# EAGLE board Main 4000 Model PI COMP REV1A (EAGLE 7.4.0)
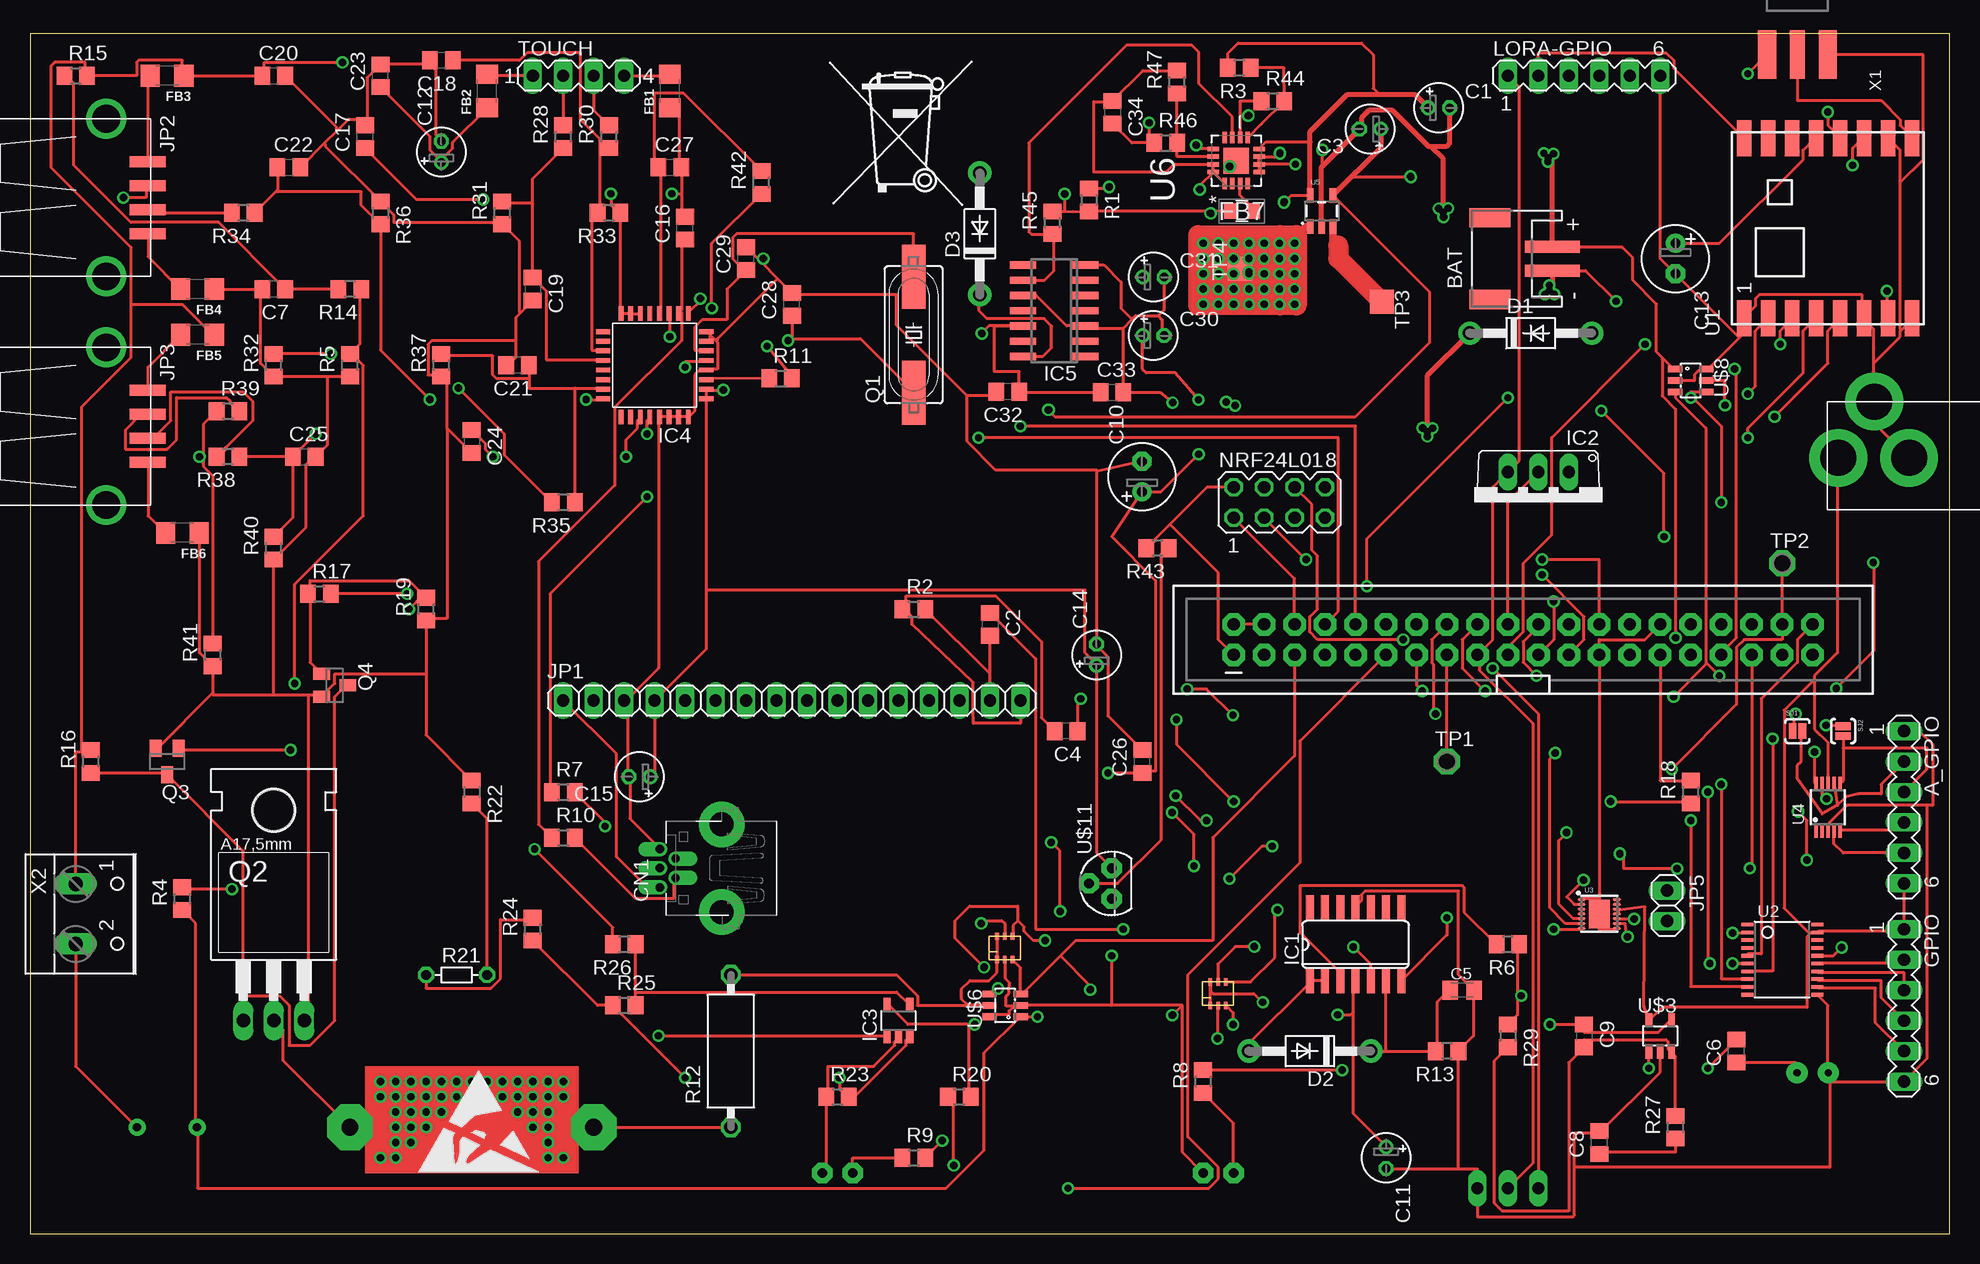
[diagram p4: board, top side]
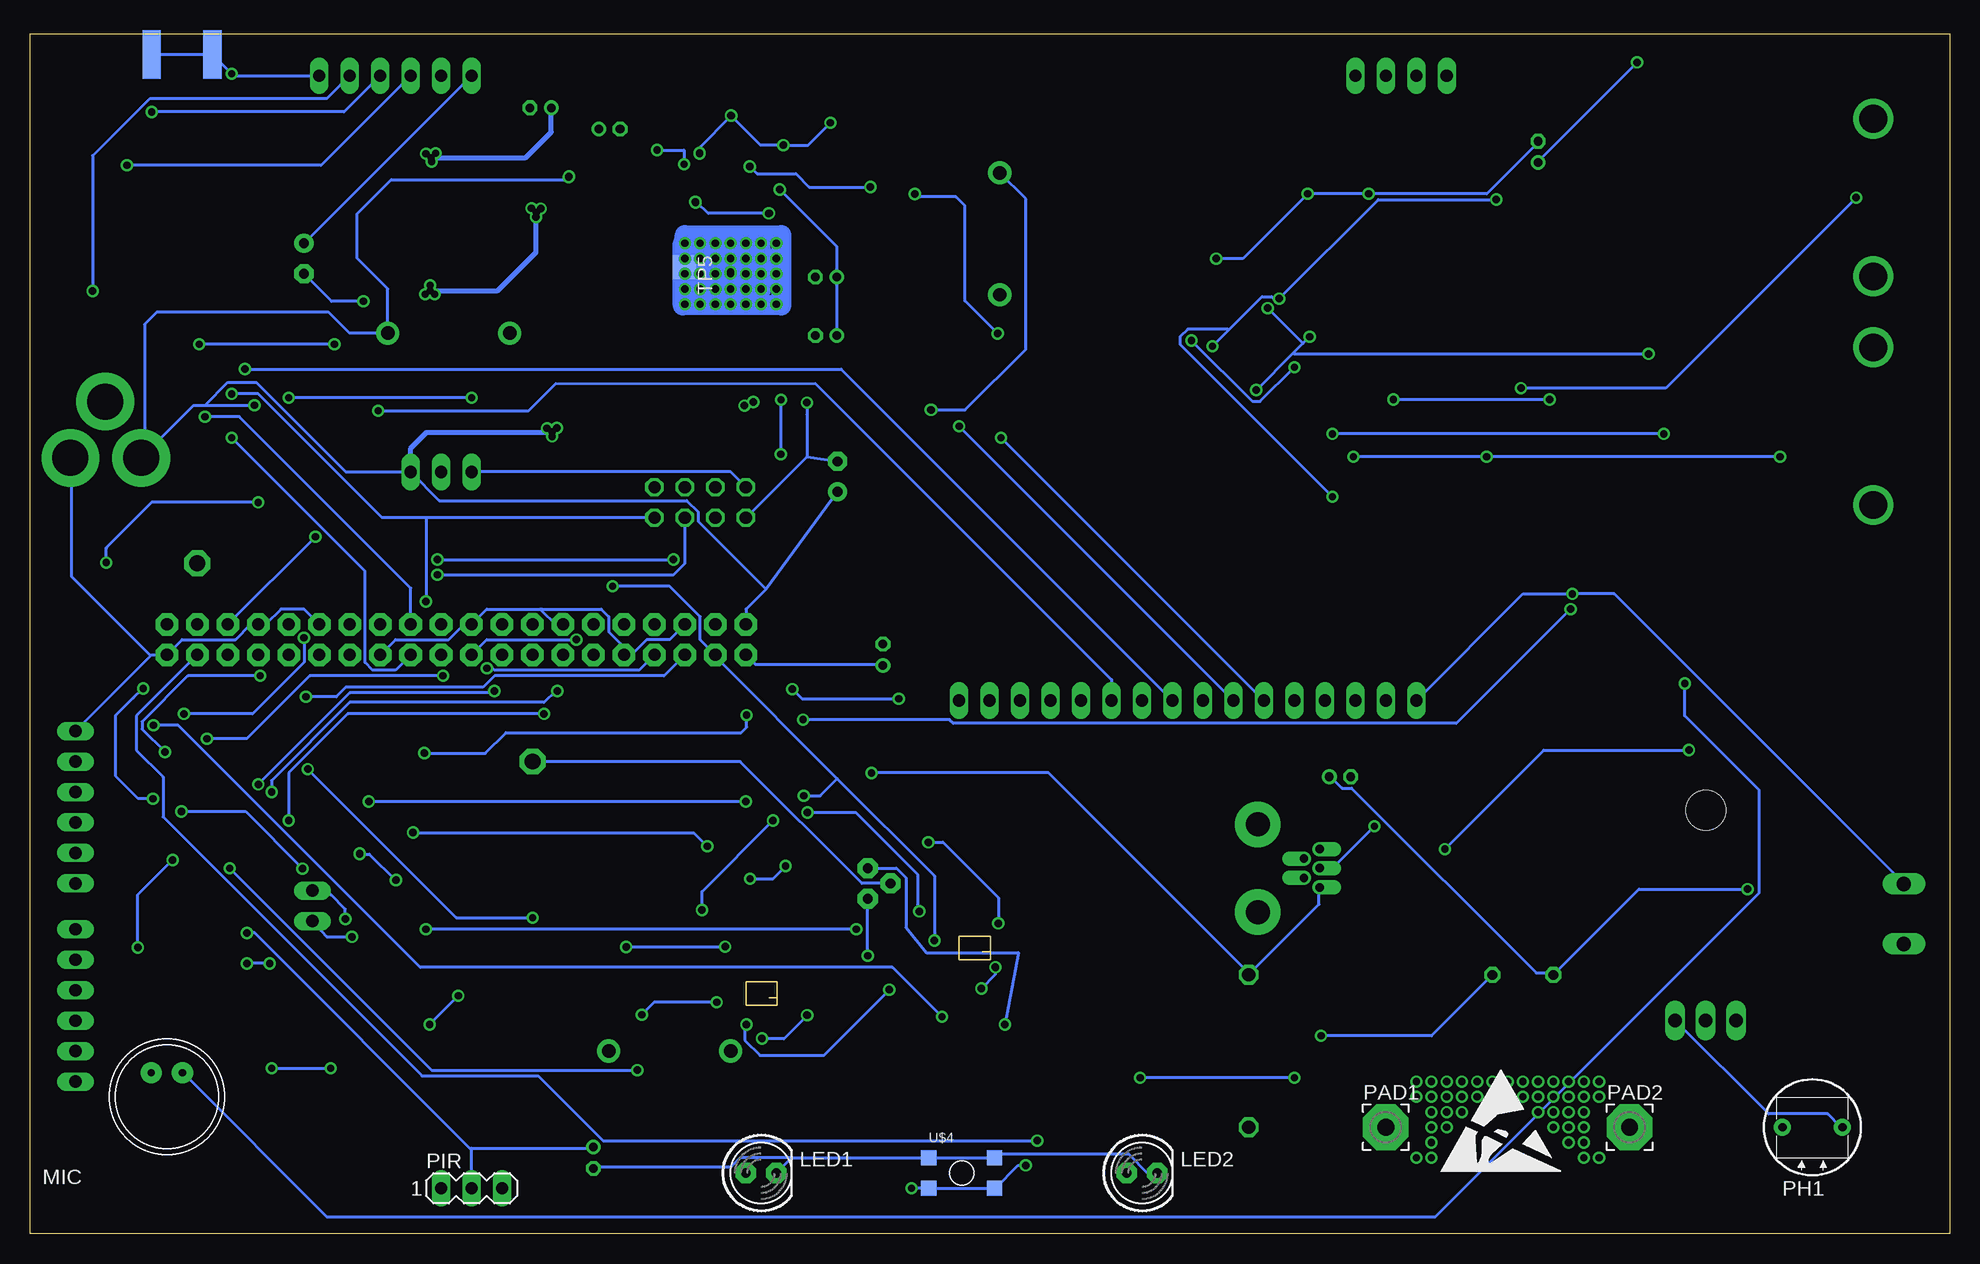
[diagram p5: board, bottom side, seen from below]

Size 160 x 100 mm. Coordinates in mm from the lower left corner, seen from the top.
Outline: 0,0 160,0 160,100 0,100 0,0
Copper layers (1*16): Top 0.035mm / dielectric 1.5mm / Bottom 0.035mm
Design rules "default": minimum track width 10mil, minimum drill 24mil, track to track 8mil, track to pad 8mil, pad to pad 8mil, via to via 8mil, smd to smd 8mil, copper to edge 40mil, drill to drill 8mil, minimum pad ring 10mil, minimum via ring 8mil, stop-mask expansion 4mil, vias tented up to drill 0mil, thermal gap 10mil

## Footprints (pad centres in the part's own frame; a part is rotated, then mirrored left to right if it is on the bottom)
MA06-1 = drill 1.016 long: 1 -6.35,0; 2 -3.81,0; 3 -1.27,0; 4 1.27,0; 5 3.81,0; 6 6.35,0
JST-PH-2-SMT-RA = smd 1 x 4.6: 1 1,-3.7; 2 -1,-3.7 | smd 1.6 x 3.4: NC1 -3.4,1.5; NC2 3.4,1.5
E1,8-4 = drill 0.711 pad 1.168: + -0.889,0 | drill 0.711 pad 1.168 octagon: - 0.889,0
C0805 = smd 1.3 x 1.5: 1 -0.95,0; 2 0.95,0
C0805K = smd 1.3 x 1.6: 1 -1,0; 2 1,0
E2,5-6 = drill 0.813 pad 1.6: + -1.27,0 | drill 0.813 pad 1.6 octagon: - 1.27,0
USB-MINIB-THM-MOLEX = drill 0.7 offset: D+ 0,9.72; D- -0.8,8.42; GND 1.6,9.72; ID 0.8,8.42; VBUS -1.6,9.72 | drill 2 pad 3.81: GND1 -3.65,4.57; GND4 3.65,4.57
DO41-10 = drill 1.118 pad 1.93: A 5.08,0; C -5.08,0
FB1206 = smd 1.6 x 1.8: 1 -1.4,0; 2 1.4,0
SMD0805-A = smd 1 x 1.3: P$1 -1,0; P$2 1,0
SO14 = smd 0.66 x 2.032: 1 -3.81,-3.073; 2 -2.54,-3.073; 3 -1.27,-3.073; 4 0,-3.073; 5 1.27,-3.073; 6 2.54,-3.073; 7 3.81,-3.073; 8 3.81,3.073; 9 2.54,3.073; 10 1.27,3.073; 11 0,3.073; 12 -1.27,3.073; 13 -2.54,3.073; 14 -3.81,3.073
TO220V = drill 1.016 long: 1 -2.54,-2.54; 2 0,-2.54; 3 2.54,-2.54
DBV-R-PDSO-G5 = smd 0.6 x 1.2: 1 -0.95,-1.306; 2 0,-1.306; 3 0.95,-1.306; 4 0.95,1.306; 5 -0.95,1.306
LQFP32 = smd 0.4 x 1.2: 1 -2.8,-4.3; 2 -2,-4.3; 3 -1.2,-4.3; 4 -0.4,-4.3; 5 0.4,-4.3; 6 1.2,-4.3; 7 2,-4.3; 8 2.8,-4.3; 17 2.8,4.3; 18 2,4.3; 19 1.2,4.3; 20 0.4,4.3; 21 -0.4,4.3; 22 -1.2,4.3; 23 -2,4.3; 24 -2.8,4.3 | smd 1.2 x 0.4: 9 4.3,-2.8; 10 4.3,-2; 11 4.3,-1.2; 12 4.3,-0.4; 13 4.3,0.4; 14 4.3,1.2; 15 4.3,2; 16 4.3,2.8; 25 -4.3,2.8; 26 -4.3,2; 27 -4.3,1.2; 28 -4.3,0.4; 29 -4.3,-0.4; 30 -4.3,-1.2; 31 -4.3,-2; 32 -4.3,-2.8
SO14' = smd 0.6 x 2.2: 1 -3.81,-2.6; 2 -2.54,-2.6; 3 -1.27,-2.6; 4 0,-2.6; 5 1.27,-2.6; 6 2.54,-2.6; 7 3.81,-2.6; 8 3.81,2.6; 9 2.54,2.6; 10 1.27,2.6; 11 0,2.6; 12 -1.27,2.6; 13 -2.54,2.6; 14 -3.81,2.6
1X16 = drill 1.016 long: 1 -19.05,0; 2 -16.51,0; 3 -13.97,0; 4 -11.43,0; 5 -8.89,0; 6 -6.35,0; 7 -3.81,0; 8 -1.27,0; 9 1.27,0; 10 3.81,0; 11 6.35,0; 12 8.89,0; 13 11.43,0; 14 13.97,0; 15 16.51,0; 16 19.05,0
USB-A-S = smd 3 x 0.9: D+ 3.45,-1; D- 3.45,1; GND 3.45,-3; VBUS 3.45,3 | drill 2.311: P$5 0,-6.566; P$6 0,6.566
2X20-SHROUDED = drill 1.016 pad 1.88 octagon: 1 -1.27,24.13; 2 1.27,24.13; 3 -1.27,21.59; 4 1.27,21.59; 5 -1.27,19.05; 6 1.27,19.05; 7 -1.27,16.51; 8 1.27,16.51; 9 -1.27,13.97; 10 1.27,13.97; 11 -1.27,11.43; 12 1.27,11.43; 13 -1.27,8.89; 14 1.27,8.89; 15 -1.27,6.35; 16 1.27,6.35; 17 -1.27,3.81; 18 1.27,3.81; 19 -1.27,1.27; 20 1.27,1.27; 21 -1.27,-1.27; 22 1.27,-1.27; 23 -1.27,-3.81; 24 1.27,-3.81; 25 -1.27,-6.35; 26 1.27,-6.35; 27 -1.27,-8.89; 28 1.27,-8.89; 29 -1.27,-11.43; 30 1.27,-11.43; 31 -1.27,-13.97; 32 1.27,-13.97; 33 -1.27,-16.51; 34 1.27,-16.51; 35 -1.27,-19.05; 36 1.27,-19.05; 37 -1.27,-21.59; 38 1.27,-21.59; 39 -1.27,-24.13; 40 1.27,-24.13
1X02 = drill 1.016 long: 1 -1.27,0; 2 1.27,0
LED5MM = drill 0.813 pad 1.676 octagon: A -1.27,0; K 1.27,0
9.7ELECTRET = drill 0.6 pad 1.778: + 1.3,2; - -1.3,2
MA04-2 = drill 1.016 octagon: 1 -3.81,-1.27; 2 -3.81,1.27; 3 -1.27,-1.27; 4 -1.27,1.27; 5 1.27,-1.27; 6 1.27,1.27; 7 3.81,-1.27; 8 3.81,1.27
3,81/1,4 = drill 1.397 pad 3.81 octagon: 1 0,0
D11XX = drill 0.7 pad 1.4: 1 -2.5,0; 2 2.5,0
MA03-1 = drill 1.016 long: 1 -2.54,0; 2 0,0; 3 2.54,0
HC49UP = smd 5.334 x 1.93: 1 -4.826,0; 2 4.826,0
TO220AH = drill 1.118 long: B -2.54,-6.35; C 0,-6.35; E 2.54,-6.35 | hole 3.302: 0,11.176
SOT23 = smd 1 x 1.4: 1 -0.95,-1.1; 2 0.95,-1.1; 3 0,1.1
R0805 = smd 1.3 x 1.5: 1 -0.95,0; 2 0.95,0
VMTB60 = drill 1.1 octagon: 1 -6.35,0; 2 6.35,0
R-5 = drill 0.813 octagon: 1 -2.54,0; 2 2.54,0
SJ_2S-NOTRACE = smd 0.635 x 1.27: 1 -0.401,0; 2 0.413,0
MA04-1 = drill 1.016 long: 1 -3.81,0; 2 -1.27,0; 3 1.27,0; 4 3.81,0
P1-13 = drill 1.321 pad 2.159 octagon: TP 0,0
TP20SQ = smd 2 x 2: TP 0,0
RFM69HCW-XXXS2 = smd 3 x 1.2: 1 -7.5,7; 2 -7.5,5; 3 -7.5,3; 4 -7.5,1; 5 -7.5,-1; 6 -7.5,-3; 7 -7.5,-5; 8 -7.5,-7; 9 7.5,-7; 10 7.5,-5; 11 7.5,-3; 12 7.5,-1; 13 7.5,1; 14 7.5,3; 15 7.5,5; 16 7.5,7
TSSOP20 = smd 0.305 x 0.991: 1 -2.925,-2.918; 2 -2.275,-2.918; 3 -1.625,-2.918; 4 -0.975,-2.918; 5 -0.325,-2.918; 6 0.325,-2.918; 7 0.975,-2.918; 8 1.625,-2.918; 9 2.275,-2.918; 10 2.925,-2.918; 11 2.925,2.918; 12 2.275,2.918; 13 1.625,2.918; 14 0.975,2.918; 15 0.325,2.918; 16 -0.325,2.918; 17 -0.975,2.918; 18 -1.625,2.918; 19 -2.275,2.918; 20 -2.925,2.918
14-TDFN = smd 0.7 x 0.25: 1 -1.475,1.2; 2 -1.475,0.8; 3 -1.475,0.4; 4 -1.475,0; 5 -1.475,-0.4; 6 -1.475,-0.8; 7 -1.475,-1.2; 8 1.475,-1.2; 9 1.475,-0.8; 10 1.475,-0.4; 11 1.475,0; 12 1.475,0.4; 13 1.475,0.8; 14 1.475,1.2 | smd 1.78 x 2.35: 15 0,0
MSOP10 = smd 0.3 x 1: 1 -1,-2.05; 2 -0.5,-2.05; 3 0,-2.05; 4 0.5,-2.05; 5 1,-2.05; 6 1,2.05; 7 0.5,2.05; 8 0,2.05; 9 -0.5,2.05; 10 -1,2.05
SOT23-5 = smd 0.55 x 1.2: 1 -0.95,-1.3; 2 0,-1.3; 3 0.95,-1.3; 4 0.95,1.3; 5 -0.95,1.3
QFN65P400X400X100-17N = smd 0.965 x 0.381: 1 -1.905,0.965; 2 -1.905,0.33; 3 -1.905,-0.33; 4 -1.905,-0.965; 9 1.905,-0.965; 10 1.905,-0.33; 11 1.905,0.33; 12 1.905,0.965 | smd 0.381 x 0.965: 5 -0.965,-1.905; 6 -0.33,-1.905; 7 0.33,-1.905; 8 0.965,-1.905; 13 0.965,1.905; 14 0.33,1.905; 15 -0.33,1.905; 16 -0.965,1.905 | smd 2.159 x 2.159: 17 0,0
SC-70 = smd 0.61 x 0.305: P$1 0,1.95; P$2 0,1.3; P$3 0,0.65; P$4 1.95,0.65; P$5 1.95,1.3; P$6 1.95,1.95
PJ-102A = drill 3 pad 4.8: RING 0.1,-3.39; RING_SW -4.6,-6.29; TIP 0.1,-9.29
SOT23-5L = smd 0.55 x 1.2: 1 -0.95,-1.3; 2 0,-1.3; 3 0.95,-1.3; 4 0.95,1.3; 5 -0.95,1.3
7914G = smd 1.27 x 1.27: 1 0,0; 2 0,5.486; 3 2.54,0; 4 2.54,5.486
SOT23-6 = smd 0.55 x 1.2: 1 -0.95,-1.3; 2 0,-1.3; 3 0.95,-1.3; 4 0.95,1.3; 5 0,1.3; 6 -0.95,1.3
TO92 = drill 0.813 pad 1.676 octagon: 1 -1.27,0; 2 0,1.905; 3 1.27,0
SMA_EDGELAUNCH = smd 4.064 x 1.524: GND@1 2.032,-2.54; GND@2 2.032,2.54 | smd 4.064 x 1.524 bottom: GND@3 2.032,2.54; GND@4 2.032,-2.54 | smd 4.064 x 1.27: P 2.032,0
W237-102 = drill 1.194 long: 1 -2.5,-1.27; 2 2.5,-1.27

## Placement (x,y rotation side)
A_GPIO  [MA06-1]  156.21,35.56 270 top
BAT  [JST-PH-2-SMT-RA]  123.19,81.28 90 top
C1  [E1,8-4]  117.43,93.85 0 top
C2  1uF  [C0805]  80.01,50.8 270 top
C3  [E1,8-4]  111.7,92.07 180 top
C4  1uF  [C0805]  86.36,41.91 180 top
C5  [C0805K]  119.38,20.32 0 top
C6  0.1uF  [C0805]  142.24,15.24 90 top
C7  0.1uF  [C0805]  20.32,78.74 180 top
C8  0.1uF  [C0805]  130.81,7.62 90 top
C9  100pf  [C0805]  129.54,16.51 270 top
C10  [E2,5-6]  92.69,63.11 90 top
C11  [E1,8-4]  113.03,6.35 270 top
C12  [E1,8-4]  34.29,90.17 90 top
C13  [E2,5-6]  137.16,81.28 270 top
C14  [E1,8-4]  88.9,48.26 90 top
C15  [E1,8-4]  50.8,38.1 180 top
C16  [C0805]  54.61,83.82 90 top
C17  [C0805]  27.94,91.44 90 top
C18  [C0805]  34.29,97.79 180 top
C19  [C0805]  41.91,78.74 270 top
C20  100uF  [C0805]  20.32,96.52 0 top
C21  [C0805]  40.64,72.39 180 top
C22  [C0805]  21.59,88.9 0 top
C23  100uF  [C0805]  29.21,96.52 90 top
C24  [C0805]  36.83,66.04 270 top
C25  [C0805]  22.86,64.77 0 top
C26  100uF  [C0805]  92.71,39.37 90 top
C27  2.2uF  [C0805]  53.34,88.9 0 top
C28  [C0805]  63.5,77.47 90 top
C29  [C0805]  59.69,81.28 90 top
C30  [E1,8-4]  93.64,74.87 0 top
C31  [E1,8-4]  93.64,79.74 0 top
C32  0.1uF  [C0805]  81.49,70.18 180 top
C33  100uF  [C0805]  90.19,70.13 0 top
C34  [C0805]  90.23,93.48 270 top
CN1  [USB-MINIB-THM-MOLEX]  62.23,30.48 90 top
D1  1N4004  [DO41-10]  125.09,75.07 0 top
D2  1N4004  [DO41-10]  106.68,15.24 180 top
D3  1N4004  [DO41-10]  79.17,83.35 90 top
FB1  [FB1206]  53.34,95.25 90 top
FB2  [FB1206]  38.1,95.25 90 top
FB3  [FB1206]  11.43,96.52 180 top
FB4  [FB1206]  13.97,78.74 180 top
FB5  [FB1206]  13.97,74.93 180 top
FB6  [FB1206]  12.7,58.42 180 top
FB7  6.8uH  [SMD0805-A]  101.01,85.24 0 top
GPIO  [MA06-1]  156.21,19.05 270 top
IC1  QUAD_OPAMPD  [SO14]  110.49,24.13 0 top
IC2  7818TV  [TO220V]  125.73,60.96 180 top
IC3  TL331  [DBV-R-PDSO-G5]  72.39,17.78 0 top
IC4  TUSB2036  [LQFP32]  52.07,72.39 180 top
IC5  DG200CJD  [SO14']  85.37,76.94 90 top
JP1  [1X16]  63.5,44.45 0 top
JP2  USB-A-S  [USB-A-S]  6.35,86.36 0 top
JP3  USB-A-S  [USB-A-S]  6.35,67.31 0 top
JP4  RASPBERRYPI-B+-GPIO  [2X20-SHROUDED]  124.46,49.53 90 top
JP5  [1X02]  136.45,27.35 270 top
LED1  [LED5MM]  99.06,5.08 0 bottom
LED2  [LED5MM]  67.31,5.08 0 bottom
LORA-GPIO  [MA06-1]  129.54,96.52 0 top
MIC  [9.7ELECTRET]  148.59,11.43 0 bottom
NRF24L01  [MA04-2]  104.14,60.96 0 top
PAD1  [3,81/1,4]  46.99,8.89 0 bottom
PAD2  [3,81/1,4]  26.67,8.89 0 bottom
PH1  D1160_12  [D11XX]  11.43,8.89 0 bottom
PIR  [MA03-1]  123.19,3.81 0 bottom
Q1  16MHZ  [HC49UP]  73.66,74.93 90 top
Q2  TIP120  [TO220AH]  20.32,24.13 0 top
Q3  BC846  [SOT23]  11.43,39.37 180 top
Q4  BC846  [SOT23]  25.4,45.72 270 top
R1  47k  [R0805]  88.27,86.17 270 top
R2  120R  [R0805]  73.66,52.07 0 top
R3  47k  [R0805]  100.79,97.17 180 top
R4  [R0805]  12.7,27.94 90 top
R5  1M  [R0805]  26.67,72.39 90 top
R6  [R0805]  123.19,24.13 180 top
R7  [R0805]  44.45,36.83 0 top
R8  [R0805]  97.79,12.7 90 top
R9  [R0805]  73.66,6.35 0 top
R10  [R0805]  44.45,33.02 0 top
R11  1.5k  [R0805]  62.56,71.3 0 top
R12  1.8R 1.8W  [VMTB60]  58.42,15.24 90 top
R13  [R0805]  118.11,15.24 180 top
R14  2k  [R0805]  26.67,78.74 180 top
R15  2k  [R0805]  3.81,96.52 0 top
R16  3.2k  [R0805]  5.08,39.37 90 top
R17  33.2k  [R0805]  24.13,53.34 0 top
R18  2.21k  [R0805]  138.43,36.83 90 top
R19  dnp  [R0805]  33.02,52.07 90 top
R20  [R0805]  77.47,11.43 0 top
R21  THERMISTOR-5  [R-5]  35.56,21.59 0 top
R22  4.75k  [R0805]  36.83,36.83 270 top
R23  4.75k  [R0805]  67.31,11.43 0 top
R24  4.75k  [R0805]  41.91,25.4 90 top
R25  332k  [R0805]  49.53,19.05 0 top
R26  2.21k  [R0805]  49.53,24.13 180 top
R27  10k  [R0805]  137.16,8.89 90 top
R28  [R0805]  44.45,91.44 90 top
R29  100k  [R0805]  123.19,16.51 270 top
R30  [R0805]  48.26,91.44 90 top
R31  15k  [R0805]  39.37,85.09 90 top
R32  10K  [R0805]  20.32,72.39 90 top
R33  15k  [R0805]  48.26,85.09 180 top
R34  [R0805]  17.78,85.09 180 top
R35  [R0805]  44.45,60.96 180 top
R36  15k  [R0805]  29.21,85.09 270 top
R37  15k  [R0805]  34.29,72.39 90 top
R38  [R0805]  16.51,64.77 180 top
R39  [R0805]  16.51,68.58 0 top
R40  15k  [R0805]  20.32,57.15 90 top
R41  15k  [R0805]  15.24,48.26 90 top
R42  100k  [R0805]  60.96,87.63 90 top
R43  47k  [R0805]  93.98,57.15 180 top
R44  [R0805]  103.6,94.41 0 top
R45  [R0805]  85.22,84.27 90 top
R46  [R0805]  94.67,90.92 0 top
R47  [R0805]  95.61,96 90 top
SJ1  SOLDERJUMPER-OLDNC2  [SJ_2S-NOTRACE]  147.32,41.91 0 top
SJ2  SOLDERJUMPER-OLDNC2  [SJ_2S-NOTRACE]  151.13,41.91 270 top
TOUCH  [MA04-1]  45.72,96.52 0 top
TP1  PTR1PAD1-13  [P1-13]  118.11,39.37 0 top
TP2  PTR1PAD1-13  [P1-13]  146.05,55.88 0 top
TP3  TPTP20SQ  [TP20SQ]  112.67,77.68 270 top
TP4  TPTP20SQ  [TP20SQ]  100.85,80.43 90 top
TP5  TPTP20SQ  [TP20SQ]  105.43,80.56 270 bottom
U1  RFM69HCW  [RFM69HCW-XXXS2]  149.86,83.82 90 top
U2  [TSSOP20]  146.05,22.86 270 top
U3  MAX98306ETD+  [14-TDFN]  130.81,26.67 0 top
U4  ADS1015  [MSOP10]  149.86,35.56 0 top
U5  MAX1555  [SOT23-5]  107.65,85.25 0 top
U6  TPS61030RSAR  [QFN65P400X400X100-17N]  100.54,89.45 90 top
U$1  TPL0401A/B  [SC-70]  82.55,22.86 90 top
U$2  2.1MMJACKTHM  [PJ-102A]  160.02,64.77 270 top
U$3  MAX4466  [SOT23-5L]  135.89,16.51 0 top
U$4  TACTILE-SWITCH-7914G  [7914G]  85.09,6.35 270 bottom
U$5  TPL0401A/B  [SC-70]  100.33,19.05 90 top
U$6  MCP3425SOT  [SOT23-6]  81.28,19.05 90 top
U$8  MCP3425SOT  [SOT23-6]  138.43,71.12 270 top
U$11  DS18B20Z  [TO92]  90.17,29.21 90 top
U$13  [ESD_10.00]  32.3,5.03 0 top
U$14  [ESD_10.00]  42.48,5.11 0 bottom
U$15  [MUELLTONNE]  65.89,85.28 0 top
X1  [SMA_EDGELAUNCH]  147.32,100.33 270 top
X2  [W237-102]  5.08,26.67 270 top

## Tracks (layer width: path | path; a pad name or v marks a point on that pad's centre or on a via)
3.3V  (via drill 0.6, 0.61)
  Top 0.254: v16.83,28.73 12.7,28.73 R4.2 | R21.1 33.02,20.48 38.42,20.48 39.21,21.27 39.21,26.19 41.91,26.19 R24.2 | C15.+ 51.75,38.1 52.07,38.42 JP1.4 56.36,48.74 56.36,53.66 | v53.34,74.77 53.34,76.68 IC4.3 | v57.78,70.33 56.52,70.33 IC4.26 56.36,70.33 56.36,69.69 IC4.25 56.36,69.53 56.36,53.66 | v25.08,73.34 R32.2 | v56.83,77.15 56.83,82.55 R42.1 | 110.33,18.52 110.33,10 113.03,7.3 C11.+ | 110.33,18.52 110.33,20.8 110.49,20.95 IC1.4 | v141.92,25.08 143.03,25.08 U2.2 | C13.+ 140.81,82.55 147.8,89.53 147.8,90.33 148.75,91.28 U1.13 | 95.01,59.13 98.11,62.23 NRF24L01.2 | 95.01,59.13 93.82,57.94 93.82,57.78 93.19,57.15 R43.2 | 78.26,17.46 73.18,17.46 71.6,19.05 IC3.5 | 78.26,17.46 78.26,11.43 R20.2 | U$11.3 88.9,31.75 C14.+ 88.9,47.47 87.95,48.42 87.95,53.66 56.36,53.66 | v78.74,17.46 78.26,17.46 | 95.01,59.13 99.06,55.09 99.06,49.53 JP4.1 | LORA-GPIO.1 124.14,95.57 124.14,64.45 IC2.3 121.92,62.23 121.92,49.53 JP4.17 120.81,48.26 120.81,46.99 125.25,42.55 125.25,5.87 PIR.2 | U$5.P$1 U$5.P$6 98.38,20.27 98.62,20.03 102.01,20.03 102.77,19.27 v102.77,19.3 | v109.02,18.28 110.09,18.28 110.33,18.52
  Bottom 0.254: v16.83,28.73 25.88,28.73 R21.1 33.02,21.75 34.45,21.75 49.85,37.15 50.64,37.15 51.59,38.1 C15.+ | v57.78,70.33 54.69,73.42 | 54.69,73.42 53.9,74.22 | 53.9,74.22 v53.34,74.77 | v25.08,73.34 54.61,73.34 54.69,73.42 | 53.9,74.22 v56.83,77.15 | v141.92,25.08 141.29,25.08 123.27,7.06 | 123.27,7.06 123.19,6.99 PIR.2 | C11.+ 113.03,7.14 123.19,7.14 123.27,7.06 | C13.+ LORA-GPIO.1 | JP4.1 99.54,47.47 88.9,47.47 C14.+ | v78.74,17.46 77.62,23.44 85.27,23.41 87,25.56 87,29.69 87.79,30.48 U$11.3 | IC2.3 101.6,63.5 NRF24L01.2 | v102.77,19.3 108,19.3 v109.02,18.28
5V  (via drill 0.6, 0.61)
  Top 0.254: JP4.4 JP4.2 | 132.4,26.99 134.62,27.27 134.53,18.98 134.94,17.94 U$3.5 135.1,17.94 136.05,18.89 148.11,18.89 148.11,24.77 148.35,25 | 132.4,26.99 U3.12 | A_GPIO.6 GPIO.1 156.21,25.24 149.07,25.24 U2.19 148.91,25.08 148.43,25.08 148.35,25 | U4.8 149.86,40.96 148.75,42.07 148.75,46.2 | 148.75,46.2 148.75,46.51 150.65,48.42 v150.65,64.77 | U$8.5 141.29,71.12 v141.29,69.06 | 148.35,25 146.21,27.15 146.21,43.66 148.75,46.2 | v31.43,53.34 R17.2 | R12.2 72.23,21.59 73.98,19.84 73.98,19.05 U$6.5 78.17,19.05 77.64,19.58 77.64,20.41 78.33,21.11 79.92,21.11 80.6,21.78 U$1.P$1 U$1.P$6 | JP1.1 48.9,40.01 48.9,31.43 51.44,28.89 52.39,28.89 CN1.VBUS | C23.1 33.34,91.44 33.34,90.33 34.29,89.38 C12.+ 34.29,89.53 35.24,90.49 35.24,90.96 38.1,93.82 FB2.1 | 4.29,40.16 3.81,40.16 X2.1 | 4.29,40.16 5.08,40.16 R16.2 | 8.41,77.47 12.7,77.47 15.24,74.93 FB5.1 | 8.41,77.47 8.41,82.23 1.75,88.9 1.75,97.31 2.06,97.63 4.6,97.63 4.6,96.52 R15.2 8.89,96.52 8.89,97.63 9.05,97.79 12.7,97.79 12.7,96.52 FB3.1 C20.1 19.53,96.52 19.53,97.63 v26.04,97.63 | 4.29,40.16 4.29,68.9 8.41,73.03 8.41,77.47 | v89.85,38.42 C26.1 92.71,38.58 93.82,38.58 93.82,54.45 90.17,58.1 C10.+ 94.27,61.84 v97.4,64.97 | 132.4,26.99 132.4,26.78 U3.11 | R47.2 92.76,96.95 C34.1 90.23,94.36 88.68,94.36 88.68,88.49 94.69,88.49 95.32,89.12 U6.15 U6.16 | v97.4,69.52 95.45,71.76 93.06,71.76 92.75,72.07 C30.+ | U6.1 U6.16 | U6.16 97.53,87.37 v97.53,87.06
  Top 0.406: v116.49,66.84 116.49,71.54 D1.C
  Bottom 0.254: JP4.2 100.33,52.07 98.66,53.74 | C10.+ 98.66,53.74 | 145.41,69.06 146.37,69.06 v150.65,64.77 | 145.41,69.06 v141.29,69.06 | 145.41,69.06 143.51,70.96 141.13,70.96 133.67,63.5 IC2.1 125.89,61.12 105.25,61.12 104.3,60.17 104.3,59.37 98.66,53.74 | JP1.1 35.56,53.34 v31.43,53.34 27.94,53.34 3.81,29.21 X2.1 | CN1.VBUS 52.55,28.73 52.55,27.46 R12.2 58.42,21.75 75.09,38.42 v89.85,38.42 | v26.04,97.63 34.29,89.38 C12.+ | C30.+ 92.75,79.73 C31.+ 92.75,82.29 v97.53,87.06 | v97.4,64.97 97.4,69.14 v97.4,69.52
  Bottom 0.406: IC2.1 128.27,65.47 126.94,66.79 116.54,66.79 v116.49,66.84
AMP
  Top 0.254: JP4.40 147.32,49.53 147.32,47.62 144.3,44.61 144.3,23.34 143.19,23.34 U2.5
AMP_PWR  (via drill 0.6)
  Top 0.254: U2.16 150.32,23.18 v151,23.87 | v148.11,31.17 148.11,34.46 v147.36,35.21 | v137.26,30.45 132.85,30.45 132.84,30.46 132.84,31.34 v132.51,31.66 | v129.52,29.47 129.49,29.47 128.1,28.08 128.71,27.47 U3.2
  Bottom 0.254: v151,23.87 151,28.27 v148.11,31.17 | v147.36,35.21 142.02,35.21 v137.26,30.45 | v132.51,31.66 131.72,31.66 v129.52,29.47
AUDIO_GND
  Top 0.254: JP1.16 82.55,42.55 78.63,42.55 78.62,43.74 78.62,45.97 73.5,50.8 73.5,51.44 72.87,52.07 R2.1 73.03,52.07 73.03,53.18 80.49,53.18 84.3,49.37 84.3,43.02 C4.2
AUDIO_R
  Top 0.254: JP1.15 80.01,46.67 | 80.01,46.67 C2.2 | 80.01,46.67 R2.2
CS  (via drill 0.61)
  Top 0.254: v145.41,68.1 149.86,72.55 149.86,75.25 150.81,76.2 U1.5
  Bottom 0.254: v145.41,68.1 142.56,68.1 128.27,53.82 JP4.24
DM1
  Top 0.254: IC4.11 47.62,73.66 46.83,73.66 46.83,84.61 R33.2 47.47,85.09 47.47,91.12 47.55,91.2 | C18.1 40.8,97.79 41.43,98.42 45.88,98.42 45.88,92.87 47.55,91.2 | 47.55,91.2 R30.1
DM2
  Top 0.254: 45.4,70.48 41.59,70.48 41.59,71.28 | 45.4,70.48 47.62,70.48 IC4.15 | 41.59,71.28 C21.1 | 41.59,71.28 38.89,71.28 38.58,71.6 38.58,73.18 34.29,73.18 R37.2 | 45.4,70.48 R35.1
DM3  (via drill 0.61)
  Top 0.254: v49.69,64.77 49.69,66.2 50.64,67.15 50.64,67.79 50.8,67.94 IC4.19 | v38.58,64.77 37.94,65.41 37.94,65.88 C24.1 | R41.2 15.24,63.18 14.45,63.98 14.45,64.77 | 14.45,64.77 14.45,67.47 R39.1 | 14.45,64.77 v14.13,64.77
  Bottom 0.254: v49.69,64.77 v38.58,64.77 v14.13,64.77
DP1
  Top 0.254: C19.1 43.02,78.58 43.02,72.87 47.62,72.87 IC4.12 | 41.91,85.88 39.37,85.88 R31.2 | C19.1 41.91,85.88 | C19.1 | 41.91,85.88 41.91,87.95 R28.1
DP2  (via drill 0.61)
  Top 0.254: 20.56,86.92 20.64,87 C22.1 | 20.56,86.92 R34.1 | v46.35,69.53 47.62,69.53 IC4.16 | v33.34,69.53 29.21,73.66 R36.2 | R36.2 27.62,85.72 27.62,86.84 20.64,86.84 20.56,86.92 | R36.2
  Bottom 0.254: v33.34,69.53 v46.35,69.53
DP3  (via drill 0.61)
  Top 0.254: v51.44,66.67 51.44,67.79 51.59,67.94 IC4.20 | v23.81,66.67 22.07,64.93 22.07,64.77 C25.1 | C25.1 21.91,59.69 R40.2 | C25.1 R38.1
  Bottom 0.254: v23.81,66.67 v51.44,66.67
ENABLE
  Top 0.254: IC5.9 84.57,79.48 85.35,80.26 85.35,83.19 R45.1 83.47,83.32 83.27,83.52 83.27,90.93 91.39,99.05 96.84,99.05 97.43,98.46 97.43,95.86 100.21,93.08 U6.11
FB
  Top 0.254: R47.1 R46.2 95.62,89.78 U6.14
GND  (via drill 0.6, 0.61)
  Top 0.254: X2.2 3.81,13.97 8.89,8.89 PH1.2 | FB4.1 19.21,78.74 | 19.21,78.74 C7.2 | 24.77,71.44 R5.1 | 24.77,71.44 R32.1 | 24.77,71.44 24.77,65.72 C25.2 23.65,64.77 23.02,64.14 23.02,58.9 R40.1 | 19.21,78.74 19.21,72.55 R32.1 | R32.1 | 33.02,46.67 R19.1 33.02,51.28 34.77,51.28 34.77,66.99 34.85,67.07 | 33.02,46.67 33.02,41.59 R22.1 | 15.16,45.01 15.24,45.09 R41.1 | 15.16,45.01 10.64,40.48 Q3.2 | 20.32,44.93 15.24,44.93 15.16,45.01 | 20.32,44.93 23.18,44.93 | 23.18,44.93 24.29,44.93 Q4.2 24.45,44.93 25.4,45.88 25.4,46.67 33.02,46.67 | 20.32,44.93 R40.1 | R41.1 14.13,48.42 14.13,58.42 FB6.1 | R41.1 | R40.1 | Q2.E 23.18,18.1 23.18,44.93 | CN1.GND 52.39,32.23 50.01,34.61 50.01,38.1 C15.- 49.85,38.1 49.85,44.13 JP1.3 49.69,44.45 52.39,47.15 52.39,67.94 IC4.21 52.55,68.1 53.18,68.1 IC4.22 53.34,68.1 53.98,68.1 IC4.23 54.13,68.1 54.77,68.1 IC4.24 54.93,68.1 55.4,68.58 55.4,71.6 55.72,71.91 56.36,71.91 IC4.28 56.52,72.07 57.31,72.07 57.31,74.3 57.23,74.37 | 60.88,81.04 C29.2 | 60.88,81.04 62.31,79.61 | 62.31,79.61 C28.2 63.5,78.26 72.23,78.26 72.23,75.72 78.11,69.85 | 56.75,74.85 56.52,75.09 IC4.32 | 56.75,74.85 57.23,74.37 | IC4.31 56.52,74.45 56.67,74.61 56.67,74.77 56.75,74.85 | 62.31,79.61 57.31,74.61 57.31,74.45 57.23,74.37 | 34.85,67.07 C24.2 | 34.85,67.07 34.77,67.15 34.77,70.96 R37.1 34.29,71.6 33.18,71.6 33.18,74.14 33.5,74.45 40.48,74.45 | 40.48,74.45 40.48,76.36 40.88,76.76 | 40.48,74.45 40.48,73.03 39.85,72.39 C21.2 | 40.88,76.76 C19.2 | 40.88,76.76 40.8,76.83 40.8,82.71 R31.1 39.37,84.3 30.32,84.3 30.32,84.93 R36.1 | 25.64,92 26.51,92.87 27.94,92.87 | 25.64,92 24.53,90.88 | 24.53,90.88 C22.2
  Top 0.254: 27.94,92.87 C17.2 | R36.1 24.61,90.65 24.61,90.81 24.53,90.88 | C20.2 25.56,92.23 25.56,92.08 25.64,92 | 54.29,86.68 C27.2 54.13,88.9 54.13,93.03 53.34,93.82 FB1.1 | 54.29,86.68 54.29,85.09 C16.2 | IC4.6 50.8,76.68 50.16,76.68 IC4.7 50.01,76.68 49.37,76.68 IC4.8 49.21,76.83 R33.1 49.05,85.09 48.42,85.72 v48.42,86.68 | 33.34,97.47 C23.2 | 33.34,97.47 C18.2 33.34,97.47 | 33.34,97.47 33.81,97 33.81,91.6 34.29,91.12 C12.- | v53.5,86.68 54.29,86.68 | 27.94,92.87 28.1,93.03 28.1,96.36 C23.2 | C23.2 | R36.1 | v61.12,81.28 60.88,81.04 | R13.1 120.33,16.51 120.33,20.32 | 120.33,20.32 119.06,21.59 119.06,28.57 111.28,28.57 110.97,28.26 110.97,27.78 110.49,27.3 IC1.11 | 120.33,20.32 C5.2 | U$3.2 135.89,13.49 130.81,8.41 | 119.06,5.4 120.65,5.4 PIR.3 120.65,1.43 128.59,1.43 128.75,1.59 128.75,5.56 | 119.06,5.4 113.03,5.4 C11.- | 130.81,8.41 128.75,8.41 128.75,5.56 | 130.81,8.41 C8.2 | 119.06,5.4 R13.1 | R13.1 | IC3.2 72.39,16.35 72.07,16.03 72.07,15.72 70.33,13.97 66.52,13.97 66.52,11.43 R23.1 66.36,5.4 LED2.K | 82.01,18.98 81.6,18.57 81.6,18.26 80.01,18.26 U$6.6 | 96.04,19.05 90.17,19.05 | 90.17,19.05 U$6.2 82.07,19.05 82.01,18.98 | 96.04,19.05 96.04,6.83 LED1.K | 90.17,19.05 v90.17,23.18 | v143.19,96.68 144.78,98.27 X1.GND@4 | U$8.2 138.75,71.12 138.75,71.6 139.06,71.91 139.7,71.91 U$8.6 139.86,72.07 142.48,74.69 | 142.48,74.69 142.72,74.93 142.72,76.2 U1.1 142.88,76.36 143.83,77.31 143.83,77.95 144.15,78.26 152.72,78.26 152.72,76.36 U1.6 152.88,76.2 153.67,75.41 153.67,72.55 | 142.48,74.69 C13.- 135.89,81.28 LORA-GPIO.6 | 153.67,72.55 153.67,69.37 U$2.RING_SW 153.83,69.22 153.83,67.47 156.53,64.77 U$2.RING
  Top 0.254: 155.97,75.33 155.89,75.25 155.89,74.77 153.67,72.55 | 155.97,75.33 156.84,76.2 U1.8 | 155.89,87.63 155.89,75.41 155.97,75.33 | 155.89,87.63 155.89,90.33 154.94,91.28 U1.10 | 155.89,87.63 157.8,89.53 157.8,98.27 149.86,98.27 X1.GND@3 | C26.2 89.85,43.18 89.85,48.1 88.9,49.05 C14.- 88.9,63.5 88.98,63.58 | NRF24L01.1 105.41,54.61 JP4.6 | C10.- 88.98,63.58 | IC2.2 123.19,60.96 JP4.20 | 130.81,27.94 129.38,27.94 U3.1 | 130.81,27.94 U3.15 130.81,25.4 132.24,25.4 U3.8 | 130.81,27.94 JP4.25 130.81,49.53 134.62,49.53 JP4.30 | U2.11 149.07,19.84 149.86,19.05 149.86,13.49 MIC.- | 150.02,12.7 GPIO.6 158.12,14.61 158.12,35.72 | 150.02,12.7 150.02,13.34 MIC.- | U4.3 149.86,34.13 151.45,35.72 158.12,35.72 | 158.12,35.72 158.59,35.72 158.59,40.8 157.48,41.91 A_GPIO.1 | 128.75,5.56 150.02,5.56 150.02,12.7 | 150.02,12.7 MIC.- | 78.11,69.85 78.11,66.04 80.49,63.66 88.9,63.66 88.98,63.58 | 96.04,19.05 95.22,18.22 v95.2,18.22 | v98.97,16.26 99.03,16.33 U$5.P$2 | 82.01,18.98 81.37,18.98 81.37,19.8 81.59,20.03 81.59,20.59 81.66,20.65 81.66,20.93 81.3,21.28 81.3,22.81 U$1.P$2 | BAT.2 129.66,80.28 v132.21,77.72 | U6.6 U6.5 | U6.6 U6.7 103.95,89.78 v104.18,90.01 | C34.2 91.84,90.92 R46.1 93.28,91.36 v93.28,92.59 | 91.14,75.48 C33.2 94.18,70.13 95.11,69.39 v95.25,69.28 | 91.14,75.48 91.86,76.21 | 91.86,76.21 92.18,76.52 94.05,76.52 | 94.05,76.52 94.37,76.2 94.37,75.02 C30.- | C31.- 94.53,77 94.05,76.52 | C32.2 80.21,69.85 78.11,69.85 | IC5.10 83.86,78.21 86.4,75.67 IC5.3 88.16,75.48 91.14,75.48 | IC5.7 89.52,80.75 90.94,79.33 90.94,77.13 91.86,76.21 | v97.21,90.72 97.21,90.42 U6.13 97.2,90.42 97.19,90.42 v97.19,90.73 v97.2,90.74
  Top 0.254: 107.65,88.91 107.72,88.91 v107.72,90.32 | v105.49,89.13 102.45,89.14 U6.6 | R44.1 100.87,94.41 100.87,93.17 | 100.87,93.17 U6.10 | v101.54,93.17 100.87,93.17
  Top 0.406: C1.- 118.32,90.87 118.06,90.61 116.77,90.61 | 116.77,90.61 116.58,90.61 113.56,93.64 111.62,93.64 110.98,93 110.98,92.24 C3.- 107.65,88.91 U5.2 | BAT.2 126.89,78.85 v126.65,78.61 | v117.79,85.14 117.79,89.58 116.77,90.61
  Bottom 0.254: Q2.E 15.08,10 10.16,10 9.05,8.89 PH1.2 | C12.- 34.29,90.96 38.58,86.68 v48.42,86.68 v53.5,86.68 58.9,81.28 v61.12,81.28 | LED1.K 96.6,6.27 | 96.6,6.27 96.52,6.35 U$4.1 U$4.2 79.53,6.35 79.22,6.67 68.42,6.67 66.83,5.08 LED2.K | v90.17,23.18 U$11.1 | C11.- 113.03,5.56 101.6,5.56 100.81,6.35 96.68,6.35 96.6,6.27 | LORA-GPIO.6 143.03,96.52 v143.19,96.68 144.78,98.27 | 144.78,98.27 149.86,98.27 X1.GND@3 | 144.78,98.27 X1.GND@4 | 95.25,64.77 C10.- | NRF24L01.1 95.25,64.77 | JP4.6 106.68,49.53 108.58,49.53 109.86,48.26 JP4.9 110.49,48.9 111.76,50.16 111.76,51.44 112.39,52.07 117.32,52.07 117.4,51.99 | JP4.14 116.2,50.8 117.4,51.99 | 117.4,51.99 117.47,52.07 121.92,52.07 JP4.20 123.83,50.8 125.09,49.53 129.54,49.53 JP4.25 | JP4.30 137.16,52.07 139.06,52.07 140.34,50.8 JP4.34 141.6,50.8 142.88,49.53 147.32,49.53 JP4.39 149.86,48.26 149.94,48.18 | A_GPIO.1 149.94,48.18 | 149.94,48.18 156.53,54.77 156.53,64.61 U$2.RING | v95.2,18.22 97.16,16.26 v98.97,16.26 | v132.21,77.72 134.87,77.72 C13.- | v95.25,69.28 95.25,68.27 95.25,64.77 | v97.21,90.72 95.15,90.72 v93.28,92.59 | v107.72,90.32 105.49,90.31 v105.49,89.13 | v104.18,90.01 104.18,90.53 v101.54,93.17 99.11,90.74 v97.2,90.74
  Bottom 0.406: v126.65,78.61 121,78.61 117.82,81.8 117.82,85.11 v117.79,85.14
H_LED
  Top 0.254: JP4.29 135.89,37.78 R18.2
LED1  (via drill 0.61)
  Top 0.254: v109.38,13.65 R8.2 | v143.35,30.48 143.51,30.64 JP4.35
  Bottom 0.254: v109.38,13.65 126.52,13.65 v143.35,30.48
LED2  (via drill 0.61)
  Top 0.254: v76.04,7.78 R9.2
  Bottom 0.254: v76.04,7.78 112.24,7.78 117.63,13.18 127.32,13.18 148.91,34.77 148.91,38.1 151.13,40.32 151.13,43.18 JP4.37
MIC  (via drill 0.61)
  Top 0.254: U$3.4 136.68,17.78 135.73,16.83 129.54,16.83 C9.1 v126.68,17.46 | 123.98,19.84 123.98,24.13 R6.1 | 123.98,19.84 123.98,18.26 R29.1 | 123.98,19.84 v124.3,19.84
  Bottom 0.254: v124.3,19.84 v126.68,17.46
MISO  (via drill 0.61)
  Top 0.254: v143.19,70.01 143.83,70.64 143.83,75.25 144.78,76.2 U1.2 | JP4.21 127,49.53 v127,52.7
  Bottom 0.254: v143.19,70.01 140.97,70.01 130.65,59.69 127,59.69 | NRF24L01.7 127,59.69 | 127,59.69 v127,52.7
MOSI  (via drill 0.61)
  Top 0.254: v145.89,74.14 145.89,75.25 146.84,76.2 U1.3 | v134.62,74.14 126.84,66.36 126.84,58.26 124.46,55.88 124.46,50.16 123.19,48.9 JP4.19 | NRF24L01.6 106.84,60.8 106.84,56.99 107.31,56.52 107.31,52.07 106.68,51.44 106.68,50.16 107.31,49.53 v114.46,49.53
  Bottom 0.254: v134.62,74.14 v145.89,74.14 | v114.46,49.53 121.92,49.53 JP4.19
N$1  (via drill 0.61)
  Top 0.254: v154.78,78.58 154.78,76.36 U1.7
  Bottom 0.254: v154.78,78.58 154.78,89.85 150.02,94.61 135.25,94.61 LORA-GPIO.5
N$2
  Top 0.254: X1.P 147.32,94.46 154.31,94.46 155.89,92.87 155.89,92.39 156.84,91.44 U1.9
N$3  (via drill 0.61)
  Top 0.254: v149.86,93.5 149.86,92.39 150.81,91.44 U1.12
  Bottom 0.254: v149.86,93.5 133.83,93.5 LORA-GPIO.4
N$4  (via drill 0.61)
  Top 0.254: v151.92,89.06 151.92,90.49 152.72,91.28 U1.11
  Bottom 0.254: v151.92,89.06 135.73,89.06 LORA-GPIO.3
N$5
  Top 0.254: LORA-GPIO.2 125.73,98.42 136.37,98.42 137,97.79 137,97.16 142.72,91.44 U1.16
N$6
  Top 0.254: D2.C 113.03,15.24 | 113.03,15.24 R13.2 117.32,15.24 117.32,19.37 118.27,20.32 C5.1 | 113.03,15.24 IC1.6
N$7  (via drill 0.6)
  other vias: 140.97,60.96
N$8  (via drill 0.6)
  other vias: 133.15,24.75
N$9  (via drill 0.61)
  Top 0.254: R14.1 27.46,78.74 27.46,74.14 R5.2 26.83,73.34 27.78,72.39 27.78,59.85 22.07,54.13 v22.07,45.88 | C6.1 147.16,14.29 147.16,13.49 MIC.+
  Bottom 0.254: v22.07,45.88 22.07,43.18 15.88,36.99 15.88,28.42 42.86,1.43 135.25,1.43 147.16,13.34 MIC.+
N$10  (via drill 0.6)
  Top 0.254: IC1.5 111.76,22.48 v110.3,23.94 | v102.05,23.95 100.47,23.95 99.01,22.49 99.01,21.02 U$5.P$5
  Bottom 0.254: v110.3,23.94 v102.06,23.94 v102.05,23.95
N$11
  Top 0.254: TOUCH.3 46.99,93.66 R30.2
N$12  (via drill 0.61)
  Top 0.254: v35.72,70.48 39.53,66.67 39.53,64.93 R35.2 | v7.78,86.36 9.68,86.36 9.68,87.31 JP2.D-
  Bottom 0.254: v35.72,70.48 23.65,70.48 v7.78,86.36
N$13  (via drill 0.6)
  other vias: 95.24,18.24
N$14  (via drill 0.6)
  other vias: 98.99,16.31
N$15
  Top 0.254: R9.1 68.58,6.35 LED2.A
N$16  (via drill 0.61)
  Top 0.254: v138.43,34.45 138.43,20.64 143.03,20.64 U2.9 | v117.16,43.34 117,43.5 117,47.47 116.84,47.62 116.84,49.53 JP4.16
  Bottom 0.254: v138.43,34.45 138.43,38.42 133.51,43.34 v117.16,43.34
N$17  (via drill 0.61)
  Top 0.254: v140.97,37.47 140.97,21.27 143.03,21.27 U2.8 | v121.28,45.24 119.38,47.15 119.38,49.53 JP4.18
  Bottom 0.254: v140.97,37.47 133.35,45.09 121.44,45.09 v121.28,45.24
N$18  (via drill 0.61)
  Top 0.254: v145.26,41.27 145.26,21.91 143.19,21.91 U2.7 | v125.57,46.51 124.46,47.62 124.46,49.37 125.73,50.64 JP4.22
  Bottom 0.254: v145.26,41.27 141.92,41.27 136.68,46.51 v125.57,46.51
N$19  (via drill 0.61)
  Top 0.254: v141.92,22.54 143.03,22.54 U2.6 | v140.02,22.54 139.86,22.7 v139.86,36.83 | v116.05,45.24 115.57,45.72 JP4.13
  Bottom 0.254: v140.02,22.54 v141.92,22.54 | v139.86,36.83 139.86,37.78 133.35,44.29 117.16,44.29 116.2,45.24 v116.05,45.24
N$20  (via drill 0.6)
  other vias: 100.28,17.45
N$21  (via drill 0.6)
  other vias: 88.4,20.37
N$22  (via drill 0.6)
  other vias: 80.7,20.45
N$23  (via drill 0.6)
  other vias: 79.54,22.24
N$24  (via drill 0.61)
  Top 0.254: v127,25.4 129.22,25.4 U3.7 | v91.12,25.4 83.82,25.4 83.82,47.94 C2.1
  Bottom 0.254: v91.12,25.4 v127,25.4
N$25  (via drill 0.6)
  other vias: 102.76,19.31
N$26  (via drill 0.6)
  Top 0.254: U3.6 128,25.87 126.68,27.19 126.68,39.6 v127.12,40.05 | v100.26,43.22 98.07,45.41 v96.46,45.41 | v87.58,44.61 87.31,44.34 C4.1
  Bottom 0.254: v127.12,40.05 122.05,40.05 120.31,41.78 100.72,41.78 100.26,42.24 v100.26,43.22 | v96.46,45.41 95.65,44.61 v87.58,44.61
N$27
  Top 0.254: A_GPIO.5 151.13,31.75 150.36,32.52 U4.4
N$28
  Top 0.254: A_GPIO.4 156.21,33.66 150.97,33.66 U4.5
N$29
  Top 0.254: SJ2.2 151.13,40.48 | 151.13,40.48 151.13,37.78 150.97,37.62 U4.6 | 151.13,40.48 158.12,40.48 158.12,38.73 A_GPIO.3
N$30
  Top 0.254: 150.65,35.71 151.39,36.42 152.38,36.68 154.31,36.67 154.31,37.47 A_GPIO.2 | 150.65,35.71 149.38,35.02 147.32,37.94 147.32,39.05 147.64,39.37 147.64,41.91 SJ1.2 | U4.7 150.65,35.71
N$31
  Top 0.254: R10.2 50.48,27.94 53.66,27.94 53.66,29.53 CN1.D-
N$32  (via drill 0.6)
  other vias: 108.99,18.27
N$33  (via drill 0.6)
  other vias: 110.32,23.89
N$34  (via drill 0.6)
  other vias: 102.07,23.92
N$35
  Top 0.254: IC1.3 109.22,21.75 105.89,25.08 105.89,29.05 119.38,29.05 119.54,28.89 119.54,26.83 R6.2
N$36  (via drill 0.6)
  other vias: 103.98,27.02
N$37  (via drill 0.6)
  other vias: 98.08,34.43
N$38
  Top 0.254: IC1.2 107.95,21.11 106.68,21.11 IC1.1 106.68,20.95 101.6,15.88 D2.A
N$39  (via drill 0.6)
  Top 0.254: v133.16,24.77 133.09,24.95 133.01,25.44 132.97,25.86 U3.9
  Bottom 0.254: JP5.2 135.26,24.77 v133.16,24.77
N$40  (via drill 0.6)
  Top 0.254: U3.10 v133.71,26.27 v133.72,26.26
  Bottom 0.254: v133.72,26.26 133.72,27.07 134.91,28.27 136.1,28.27 JP5.1
N$41  (via drill 0.6)
  other vias: 95.53,36.51
N$42  (via drill 0.6)
  other vias: 133.71,26.25
N$43
  Top 0.254: LED1.A 100.33,9.21 R8.1
N$44  (via drill 0.6)
  other vias: 151.03,23.88
N$45  (via drill 0.6)
  other vias: 148.12,31.14
N$46  (via drill 0.61)
  Top 0.254: v134.94,13.81 134.94,15.08 U$3.1 | v139.86,13.81 C6.2
  Bottom 0.254: v139.86,13.81 v134.94,13.81
N$47  (via drill 0.6)
  other vias: 147.39,35.21
N$48  (via drill 0.6)
  other vias: 137.3,30.44
N$49
  Top 0.254: R14.2 C7.1 21.11,78.74 21.11,78.9 15.72,84.3 8.41,84.3 3.65,89.06 3.65,95.89 3.02,96.52 R15.1
N$50  (via drill 0.6)
  Top 0.254: U3.5 128.64,26.27 127.43,27.48 127.43,32.78 v128.08,33.43 | v103.57,32.32 102.71,32.32 v99.98,29.59 | v97.03,30.64 97.03,33.3 v95.19,35.13 | v85.85,26.88 85.85,31.92 v85.13,32.65 | v79.29,25.88 79.52,26.11 81,26.11 81.25,25.86 U$1.P$5
  Bottom 0.254: v128.08,33.43 104.67,33.43 103.67,32.42 103.67,32.41 v103.57,32.32 | v99.98,29.59 98.07,29.59 v97.03,30.64 | v95.19,35.13 91.18,35.13 86.03,29.98 86.03,27.06 v85.85,26.88 | v85.13,32.65 83.9,32.65 79.29,28.04 v79.29,25.88
N$51
  Top 0.254: Q2.C 21.11,16.99 21.11,14.45 PAD2.1
N$52
  Top 0.254: PAD1.1 R12.1
N$53
  Top 0.254: R27.1 137.16,6.83 130.81,6.83 C8.1
N$54  (via drill 0.61)
  Top 0.254: 23.34,53.34 23.34,47.62 Q4.1 | 23.34,53.34 23.34,54.45 31.59,54.45 R19.2 32.7,53.18 v31.59,52.07 | 23.34,53.34 R17.1 | v131.76,36.04 138.43,36.04 R18.1 | v100.33,36.04 95.57,40.8 v95.57,42.86
  Bottom 0.254: v100.33,36.04 v131.76,36.04 | v95.57,42.86 83.34,42.86 83.03,42.55 41.12,42.55 v31.59,52.07
N$55  (via drill 0.6)
  other vias: 132.51,31.72
N$56  (via drill 0.61)
  Top 0.254: v52.39,16.51 71.44,16.51 IC3.1 | R21.2 38.1,34.61 R22.2
  Bottom 0.254: v52.39,16.51 43.18,16.51 R21.2
N$57  (via drill 0.6)
  other vias: 129.48,29.49
N$58  (via drill 0.61)
  Top 0.254: IC3.3 73.18,16.35 73.03,16.19 73.03,15.72 68.74,11.43 R23.2 68.1,11.43 67.47,12.06 v67.47,13.02 | R24.1 47.31,19.05 R25.1 48.74,19.05 48.74,18.89 v54.61,13.02
  Bottom 0.254: v54.61,13.02 v67.47,13.02
N$59  (via drill 0.6)
  other vias: 127.13,40.09
N$60  (via drill 0.6)
  other vias: 100.27,43.24
N$61
  Top 0.254: 50.48,20.16 72.23,20.16 73.18,19.21 IC3.4 | 50.48,20.16 R25.2 | 50.48,20.16 R26.1
N$62  (via drill 0.61)
  Top 0.254: v21.72,40.32 12.38,40.32 Q3.1 | v42.07,32.07 48.58,25.56 R26.2
  Bottom 0.254: v21.72,40.32 33.81,40.32 v42.07,32.07
N$63  (via drill 0.6)
  other vias: 96.46,45.4
N$64
  Top 0.254: GPIO.2 156.21,22.54 149.07,22.54 U2.15
N$65
  Top 0.254: GPIO.3 156.21,21.75 149.07,21.75 U2.14
N$66
  Top 0.254: GPIO.4 154.31,19.68 154.31,21.11 149.07,21.11 U2.13
N$67
  Top 0.254: GPIO.5 153.83,17.62 153.83,20.48 149.07,20.48 U2.12
N$68  (via drill 0.6)
  other vias: 87.6,44.59
N$69
  Top 0.254: R27.2 137.16,14.76 136.84,15.08 U$3.3 136.68,15.24 136.53,15.4 136.53,16.03 136.37,16.19 129.54,16.19 C9.2 128.27,14.29 128.27,1.91 122.71,1.91 122.08,2.54 122.08,14.45 R29.2
N$70  (via drill 0.6)
  other vias: 128.08,33.47
N$71  (via drill 0.6)
  other vias: 103.53,32.31
N$72  (via drill 0.6)
  other vias: 99.99,29.61
N$73  (via drill 0.6)
  other vias: 95.2,35.12
N$74  (via drill 0.6)
  other vias: 97.03,30.68
N$75  (via drill 0.6)
  other vias: 85.87,26.88
N$76  (via drill 0.6)
  other vias: 85.1,32.63
N$77  (via drill 0.6)
  other vias: 79.27,25.88
N$78  (via drill 0.6)
  other vias: 149.74,36.28
N$79  (via drill 0.6)
  other vias: 150.56,45.43
N$80  (via drill 0.6)
  other vias: 153.64,55.95
N$81  (via drill 0.6)
  other vias: 115.08,88.12
N$82  (via drill 0.6)
  other vias: 126.28,78.31
N$83  (via drill 0.6)
  other vias: 127.07,78.31
N$84  (via drill 0.6)
  other vias: 126.65,79.05
N$85  (via drill 0.6)
  other vias: 117.83,84.75
N$86  (via drill 0.6)
  other vias: 118.2,85.47
N$87  (via drill 0.6)
  other vias: 117.42,85.45
N$88  (via drill 0.6)
  other vias: 132.19,77.72
N$89  (via drill 0.6)
  other vias: 126.53,89.37
N$90  (via drill 0.6)
  other vias: 127,90.02
N$91  (via drill 0.6)
  other vias: 126.19,90.05
N$92  (via drill 0.6)
  other vias: 116.91,67.14
N$93  (via drill 0.6)
  other vias: 116.47,66.46
N$94  (via drill 0.6)
  other vias: 116.08,67.16
N$95
  Top 0.61: U5.3 108.6,82.83 109.05,82.38
  Top 1.676: 109.05,82.38 109.05,81.3 TP3.TP
N$96  (via drill 0.6)
  Top 0.61: U5.1 106.31,83.95 105.6,83.24
  Top 1.676: 105.6,83.24 105.6,77.39 104.19,77.39 104.19,78.58 | 104.19,83.24 105.56,83.24 105.56,77.39 97.39,77.39 97.39,83.24 104.19,83.24 | 104.19,83.24 104.19,80.01 | 104.19,80.01 104.19,78.58 | 104.19,78.58 98.32,78.58 98.32,81.83 98.93,81.83 98.93,81.91 102.93,81.91 102.93,80.27 102.91,80.27 102.91,80.19 v101.6,80.19 | v101.6,80.19 101.56,80.19 101.56,80.27 99.81,80.27 99.81,80.04 99.26,80.04 99.26,80.8 99.43,80.8 99.43,81.01 102.72,81.01 102.72,79.53 103.18,79.53 103.18,77.83 TP4.TP | v101.6,80.19 101.6,80.01 104.19,80.01
  Bottom 1.676: TP5.TP 105.43,83.24 97.39,83.24 97.39,77.39 105.6,77.39 105.6,82.55 105.56,82.55 105.56,81.91 99.06,81.91 99.06,78.74 104.19,78.74 104.19,81.01 | 104.19,81.28 104.19,81.01 | 104.19,81.01 99.43,81.01 99.43,80.01 102.72,80.01 102.72,80.19 v101.6,80.19
N$97  (via drill 0.6)
  other vias: 97.79,82.55
N$98  (via drill 0.6)
  other vias: 99.06,82.55
N$99  (via drill 0.6)
  other vias: 100.33,82.55
N$100  (via drill 0.6)
  other vias: 101.6,82.55
N$101  (via drill 0.6)
  other vias: 102.87,82.55
N$102  (via drill 0.61)
  Top 0.254: v47.94,33.97 47.94,34.29 R7.2
  Bottom 0.254: v47.94,33.97 51.44,30.48 CN1.D+
N$103  (via drill 0.61)
  Top 0.254: v55.88,77.95 55.88,77.79 54.93,76.83 IC4.1 | v61.44,73.98 63.51,71.42 R11.2 | v51.44,61.44 43.34,53.34 43.34,36.99 R7.1 | v37.78,86.2 32.23,86.2 C17.1
  Bottom 0.254: v61.44,73.98 60.09,75.33 | 60.09,75.33 57.31,78.11 56.52,78.11 56.36,77.95 v55.88,77.95 47.62,86.2 v37.78,86.2 | v51.44,61.44 64.14,74.14 64.14,74.77 63.5,75.41 60.17,75.41 60.09,75.33
N$104
  Top 0.254: 54.21,76.91 54.29,76.99 54.29,82.55 C16.1 | 54.21,76.91 54.13,76.83 IC4.2 | R10.1 42.39,34.13 42.39,56.04 48.74,62.39 48.74,68.9 54.29,74.45 54.29,76.83 54.21,76.91
N$105
  Top 0.254: IC4.27 56.52,71.28 61.5,71.29 61.57,71.24 61.57,71.15 R11.1
N$106
  Top 0.254: R34.2 9.84,85.09 9.84,85.25 JP2.D+
N$107
  Top 0.254: TOUCH.2 R28.2
N$108
  Top 0.254: TOUCH.1 38.1,96.52 FB2.2
N$109
  Top 0.254: TOUCH.4 53.34,96.52 FB1.2
N$110
  Top 0.254: FB3.2 10,96.52 9.84,96.36 9.84,89.38 JP2.VBUS
N$111
  Top 0.254: FB4.2 12.54,78.74 9.84,81.44 9.84,83.34 JP2.GND
N$112
  Top 0.254: R39.2 17.3,68.58 16.67,69.22 16.67,69.37 16.35,69.69 12.22,69.69 12.22,66.2 11.43,65.41 7.94,65.41 7.94,66.99 9.21,68.26 9.68,68.26 JP3.D-
N$113
  Top 0.254: R38.2 15.72,64.77 16.35,65.41 16.35,65.56 18.57,67.79 18.57,69.37 17.78,70.17 11.75,70.17 11.75,67.79 10.32,66.36 9.84,66.36 JP3.D+
N$114
  Top 0.254: FB5.2 12.54,74.93 9.84,72.23 9.84,70.33 JP3.VBUS
N$115
  Top 0.254: FB6.2 11.27,58.42 9.84,59.85 9.84,64.29 JP3.GND
N$116
  Top 0.254: IC4.30 56.36,73.66 55.4,73.66 55.4,75.56 56.04,76.2 58.1,76.2 58.1,78.74 C29.1 59.53,80.33 58.58,81.28 58.58,83.03 58.9,83.34 73.66,83.34 Q1.2
N$117  (via drill 0.61)
  Top 0.254: v54.61,72.23 54.61,72.71 56.36,72.71 IC4.29 | C28.1 63.5,74.77 v63.18,74.45 63.5,74.61 69.22,74.61 73.66,70.17 Q1.1
  Bottom 0.254: v54.61,72.23 57.47,69.37 58.1,69.37 v63.18,74.45
N$118
  Top 0.254: IC4.4 52.55,76.83 52.55,88.9 C27.1 52.07,89.22 52.07,95.09 54.45,95.09 R42.2
N$119  (via drill 0.6)
  other vias: 104.14,82.55
N$120  (via drill 0.6)
  other vias: 105.41,82.55
N$121  (via drill 0.6)
  other vias: 105.41,81.28
N$122  (via drill 0.6)
  other vias: 105.41,80.01
N$123  (via drill 0.6)
  other vias: 105.41,78.74
N$124  (via drill 0.6)
  other vias: 105.41,77.47
N$125  (via drill 0.6)
  other vias: 104.14,77.47
N$126  (via drill 0.6)
  other vias: 102.87,77.47
N$127  (via drill 0.6)
  other vias: 101.6,77.47
N$128  (via drill 0.6)
  other vias: 100.33,77.47
N$129  (via drill 0.6)
  other vias: 99.06,77.47
N$130  (via drill 0.6)
  other vias: 97.79,77.47
N$131  (via drill 0.6)
  other vias: 97.79,78.74
N$132  (via drill 0.6)
  other vias: 97.79,80.01
N$133  (via drill 0.6)
  other vias: 97.79,81.28
N$134  (via drill 0.6)
  other vias: 99.06,81.28
N$135  (via drill 0.6)
  other vias: 100.33,81.28
N$136  (via drill 0.6)
  other vias: 101.6,81.28
N$137  (via drill 0.6)
  other vias: 102.87,81.28
N$138  (via drill 0.6)
  other vias: 104.14,81.28
N$139  (via drill 0.6)
  other vias: 104.14,80.01
N$140  (via drill 0.6)
  other vias: 102.87,80.01
N$141  (via drill 0.6)
  other vias: 101.6,80.01
N$142  (via drill 0.6)
  other vias: 100.33,80.01
N$143  (via drill 0.6)
  other vias: 99.06,80.01
N$144  (via drill 0.6)
  other vias: 99.06,78.74
N$145  (via drill 0.6)
  other vias: 100.33,78.74
N$146  (via drill 0.6)
  other vias: 101.6,78.74
N$147  (via drill 0.6)
  other vias: 102.87,78.74
N$148  (via drill 0.6)
  other vias: 104.14,78.74
N$149
  Top 0.254: TP1.TP JP4.15 | U$11.2 90.65,29.21 94.3,32.86 94.3,56.67 94.77,57.15 R43.1
  Bottom 0.254: TP1.TP 100.81,39.37 90.65,29.21 U$11.2
N$150  (via drill 0.6)
  other vias: 29.21,12.7
N$151  (via drill 0.6)
  other vias: 34.29,12.7
N$152  (via drill 0.6)
  other vias: 38.1,12.7
N$153  (via drill 0.6)
  other vias: 36.83,12.7
N$154  (via drill 0.6)
  other vias: 35.56,12.7
N$155  (via drill 0.6)
  other vias: 39.37,12.7
N$156  (via drill 0.6)
  other vias: 40.64,12.7
N$157  (via drill 0.6)
  other vias: 41.91,12.7
N$158  (via drill 0.6)
  other vias: 43.18,12.7
N$159  (via drill 0.6)
  other vias: 44.45,12.7
N$160  (via drill 0.6)
  other vias: 44.45,11.43
N$161  (via drill 0.6)
  other vias: 43.18,11.43
N$162  (via drill 0.6)
  other vias: 41.91,11.43
N$163  (via drill 0.6)
  other vias: 40.64,11.43
N$164  (via drill 0.6)
  other vias: 39.37,11.43
N$165  (via drill 0.6)
  other vias: 40.64,10.16
N$166  (via drill 0.6)
  other vias: 41.91,10.16
N$167  (via drill 0.6)
  other vias: 43.18,10.16
N$168  (via drill 0.6)
  other vias: 43.18,8.89
N$169  (via drill 0.6)
  other vias: 41.91,8.89
N$170  (via drill 0.6)
  other vias: 43.18,7.62
N$171  (via drill 0.6)
  other vias: 43.18,6.35
N$172  (via drill 0.6)
  other vias: 44.45,6.35
N$173  (via drill 0.6)
  other vias: 29.21,6.35
N$174  (via drill 0.6)
  other vias: 30.48,6.35
N$175  (via drill 0.6)
  other vias: 31.75,7.62
N$176  (via drill 0.6)
  other vias: 33.02,8.89
N$177  (via drill 0.6)
  other vias: 31.75,8.89
N$178  (via drill 0.6)
  other vias: 30.48,8.89
N$179  (via drill 0.6)
  other vias: 30.48,7.62
N$180  (via drill 0.6)
  other vias: 30.48,10.16
N$181  (via drill 0.6)
  other vias: 30.48,11.43
N$182  (via drill 0.6)
  other vias: 30.48,12.7
N$183  (via drill 0.6)
  other vias: 29.21,11.43
N$184  (via drill 0.6)
  other vias: 31.75,11.43
N$185  (via drill 0.6)
  other vias: 33.02,11.43
N$186  (via drill 0.6)
  other vias: 34.29,11.43
N$187  (via drill 0.6)
  other vias: 33.02,10.16
N$188  (via drill 0.6)
  other vias: 31.75,10.16
N$189  (via drill 0.6)
  other vias: 33.02,12.7
N$190  (via drill 0.6)
  other vias: 31.75,12.7
N$191  (via drill 0.6)
  other vias: 34.29,10.16
N$192  (via drill 0.6)
  other vias: 35.56,11.43
N$193
  Top 0.254: IC5.14 84.43,73.13 85.16,73.86 85.16,75.65 84.53,76.29 79.75,76.29 79.1,76.94 79.1,78.2 D3.C
N$194  (via drill 0.6)
  other vias: 99.71,69.33
N$195  (via drill 0.6)
  other vias: 97.43,64.97
N$196
  Top 0.254: FB7.P$2 102.01,85.4 100.87,86.54 U6.3
N$197  (via drill 0.6)
  Top 0.254: U6.17 100.04,88.95 v99.98,88.95 | v89.95,87.24 89.83,87.12 R1.1
  Bottom 0.254: v99.98,88.95 99.39,88.36 96.16,88.36 95.04,87.24 v89.95,87.24
N$198
  Top 0.254: U6.9 102.66,92.51 R44.2 104.53,97.17 R3.1
N$199  (via drill 0.6)
  other vias: 100.45,69.03
N$200  (via drill 0.6)
  other vias: 97.5,87.03
N$201  (via drill 0.6)
  other vias: 100.02,88.96
N$202  (via drill 0.6)
  other vias: 89.95,87.27
N$203  (via drill 0.6)
  other vias: 97.21,90.73
N$204  (via drill 0.6)
  other vias: 93.29,92.6
N$205  (via drill 0.6)
  other vias: 84.94,68.67
N$206  (via drill 0.6)
  other vias: 79.35,75.03
N$207  (via drill 0.6)
  other vias: 86.25,86.66
N$209  (via drill 0.6)
  other vias: 107.74,90.36
N$210  (via drill 0.6)
  other vias: 98.38,85.06
N$211  (via drill 0.6)
  other vias: 104.54,86.01
N$212  (via drill 0.6)
  other vias: 101.58,93.21
N$213  (via drill 0.6)
  other vias: 104.19,90.08
NRF_CS  (via drill 0.61)
  Top 0.254: v106.36,56.2 NRF24L01.3 | v126.05,56.2 130.81,56.2 JP4.26
  Bottom 0.254: v126.05,56.2 v106.36,56.2
PEAK  (via drill 0.61)
  Top 0.254: v118.11,26.35 118.11,24.92 114.3,21.11 IC1.7 | v136.84,38.73 142.24,44.13 142.24,48.9 142.88,49.53 146.05,49.53 JP4.38 TP2.TP
  Bottom 0.254: v118.11,26.35 124.46,26.35 v136.84,38.73
PHOTO  (via drill 0.61)
  Top 0.254: v149.7,42.39 151.13,42.39 SJ2.1 | v83.98,18.1 82.71,18.1 U$6.1 82.55,18.1 79.53,15.08 79.53,6.99 76.36,3.81 13.97,3.81 13.97,8.89 PH1.1 13.81,8.89 13.81,25.88 R4.1
  Bottom 0.254: v149.7,42.39 147.64,42.39 127.48,22.23 88.11,22.23 v83.98,18.1
PIR  (via drill 0.61)
  Top 0.254: PIR.1 125.73,43.34 v121.92,47.15
  Bottom 0.254: v121.92,47.15 121.44,47.15 121.28,46.99 109.22,46.99 JP4.7
PUSH  (via drill 0.61)
  Top 0.254: v76.99,5.71 76.99,11.11 76.68,11.43 R20.1 | JP4.11 105.89,41.12 105.89,30.96 96.52,21.59 96.52,8.1 99.06,5.56 99.06,4.6 98.27,3.81 v86.52,3.81
  Bottom 0.254: v76.99,5.71 77.63,5.71 79.53,3.81 U$4.4 U$4.3 v86.52,3.81
PWRKEY  (via drill 0.61)
  Top 0.254: v142.08,72.07 142.24,71.91 142.24,49.69 140.97,48.42 JP4.33
  Bottom 0.254: JP1.9 92.39,72.07 v142.08,72.07
PWRSTAT  (via drill 0.61)
  Top 0.254: v136.21,58.1 136.21,63.38 v130.99,68.6
  Bottom 0.254: JP1.11 69.85,46.2 94.56,70.87 116.17,70.86 118.43,68.6 v130.99,68.6 | JP4.36 v136.21,58.1
Q18
  Top 0.254: R16.1 11.43,38.42 Q3.3 17.78,31.91 17.78,19.84 | 17.78,19.84 20.8,19.84 21.59,19.05 21.59,15.72 23.34,15.72 25.4,17.78 25.4,44.77 26.35,45.72 Q4.3 | Q2.B 17.78,19.84
RX  (via drill 0.61)
  Top 0.254: v82.55,67.31 110.49,67.31 JP4.10
  Bottom 0.254: v82.55,67.31 JP1.7
SCK  (via drill 0.61)
  Top 0.254: v143.19,66.36 143.19,67.15 147.8,71.75 147.8,75.25 148.75,76.2 U1.4 | v126.05,54.93 129.54,51.44 129.54,49.53 JP4.23
  Bottom 0.254: v143.19,66.36 132.08,55.24 132.08,47.62 131.44,46.99 129.54,46.99 JP4.23 | NRF24L01.5 105.41,55.88 106.36,54.93 v126.05,54.93
SCL  (via drill 0.6, 0.61)
  Top 0.254: v148.75,40.16 148.75,37.62 U4.10 | 139.78,47.55 139.7,47.62 139.7,67.15 137.16,69.69 137.16,70.17 U$8.3 | 139.78,47.55 v140.81,46.51 | 85.89,23.18 87.15,24.45 98.58,24.45 98.58,33.02 105.41,39.85 JP4.5 | 85.89,23.18 82.71,20 U$6.3 82.58,22.18 U$1.P$3 | v137,44.77 139.78,47.55 | U$5.P$3 100.29,18.44 v100.29,17.45 | v88.37,20.34 88.37,20.7 85.89,23.18
  Bottom 0.254: v148.75,40.16 150.65,42.07 150.65,42.7 146.84,46.51 v140.81,46.51 | v137,44.77 134.46,44.77 133.67,45.56 122.24,45.56 121.28,46.51 107.16,46.51 JP4.5 | v100.29,17.45 100.43,17.3 100.43,16.16 99.15,14.88 93.83,14.88 v88.37,20.34
SDA  (via drill 0.6, 0.61)
  Top 0.254: U$6.4 80.01,20 80.46,20.45 v80.7,20.45 | v123.19,69.69 111.44,57.94 v111.44,53.98 | U$8.4 139.7,70.17 138.43,70.17 v138.43,69.69 138.59,69.69 140.97,67.31 v140.97,60.96 | v84.61,24.45 83.66,24.45 82.87,25.24 82.87,25.59 82.38,26.07 82.31,26.07 | 82.31,26.07 81.95,25.71 81.95,24.86 U$1.P$4 | v79.53,22.21 77.11,24.63 77.11,26.11 78.32,27.32 82.33,27.32 82.31,27.31 82.31,26.07 | U$5.P$4 101.73,21 103.76,23.03 103.76,26.76 v103.99,26.99 | v98.07,34.47 97.55,34.47 v95.5,36.52 | U4.9 149.36,36.27 v149.75,36.27 | v150.56,45.48 153.72,48.63 153.72,55.87 v153.64,55.95
  Bottom 0.254: v84.61,24.45 84.61,29.84 92.71,37.95 | 92.71,37.95 102.87,48.1 JP4.3 104.14,49.53 104.14,51.44 106.68,53.98 v111.44,53.98 | v123.19,69.69 v138.43,69.69 | v140.97,60.96 149.86,60.96 153.67,57.15 153.64,57.12 v153.64,55.95 | v80.7,20.45 79.53,21.62 v79.53,22.21 | v103.99,26.99 103.99,28.54 v98.07,34.47 | v95.5,36.52 94.14,36.52 92.71,37.95 | v149.75,36.27 150.99,36.27 152.84,38.13 152.84,43.23 151.41,44.66 151.38,44.66 v150.56,45.48
TX  (via drill 0.61)
  Top 0.254: v79.06,66.36 109.06,66.36 109.06,51.91 JP4.8
  Bottom 0.254: v79.06,66.36 JP1.6
VBAT  (via drill 0.6, 0.61)
  Top 0.254: 136.13,72.95 135.57,73.5 135.57,77.49 133.59,79.48 133.59,81.35 132.71,82.22 128.28,82.22 128.27,82.23 127,82.23 BAT.1 | 136.13,72.95 137,72.07 U$8.1 | v147.16,43.34 147,43.18 147,41.91 SJ1.1 | v137.16,49.69 137.16,68.74 136.05,69.85 136.05,72.87 136.13,72.95 | R45.2 86.17,85.21 | 86.17,85.21 86.93,85.2 R1.2 88.29,85.24 FB7.P$1 98.45,85.24 v98.45,85.05 | U6.8 103.03,91 106.7,91 | R3.2 99.83,98.38 100.7,99.24 111,99.24 111.98,98.26 111.98,95.47 112.48,94.97 | C33.1 82.49,70.13 C32.1 82.44,71.86 80.39,71.86 80.39,75.67 IC5.12 79.94,75.67 v79.33,75.06 | v86.22,86.68 86.22,85.25 86.17,85.21 | v104.53,85.95 105.13,86.55 U5.5
  Top 0.406: U5.5 106.7,91 106.7,91.84 109.83,94.97 112.48,94.97 115.42,94.97 C1.+ | BAT.1 126.89,89.38 v126.57,89.7
  Bottom 0.254: v147.16,43.34 141.45,43.34 137.16,47.62 v137.16,49.69 | v79.33,75.06 79.37,75.06 82.07,77.75 82.07,85.69 82.82,86.43 85.97,86.43 v86.22,86.68 | v98.45,85.05 103.47,85.05 104.38,85.95 v104.53,85.95
  Bottom 0.406: v126.57,89.7 118.69,89.7 116.56,91.83 116.56,93.83 C1.+
VCC  (via drill 0.6)
  Top 0.254: v115.1,88.06 110.11,88.06 U5.4 116.64,78.52 116.64,74.26 110.44,68.06 85.47,68.06 v84.87,68.67
  Top 0.406: C3.+ 112.59,90.54 U5.4
  Bottom 0.254: U$2.TIP 150.44,64.96 150.44,75.81 149.45,76.8 135.1,76.8 133.37,75.07 D1.A 130.17,78.76 132.74,81.32 132.74,85.01 129.88,87.86 115.29,87.86 v115.1,88.06 | v84.87,68.67 82.05,68.67 76.99,73.72 76.99,86.25 D3.A
(copper drawn outside any net)
  shapes: Top area x1